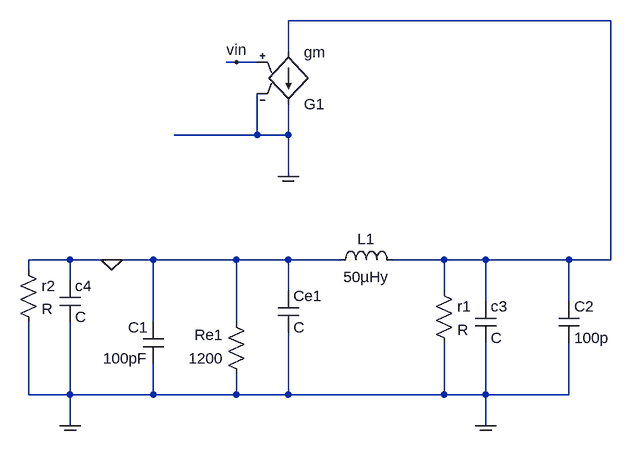
[diagram p0: schematic Collpits_g.asc]
Collpits_g.asc, the LTspice schematic file:
Version 4
SHEET 1 880 680
WIRE 720 -16 224 -16
WIRE 224 32 224 -16
WIRE 144 48 128 48
WIRE 176 48 144 48
WIRE 176 160 176 96
WIRE 176 160 48 160
WIRE 224 160 224 112
WIRE 224 160 176 160
WIRE 224 224 224 160
WIRE -112 352 -176 352
WIRE -48 352 -112 352
WIRE 16 352 -48 352
WIRE 144 352 16 352
WIRE 224 352 144 352
WIRE 304 352 224 352
WIRE 464 352 384 352
WIRE 528 352 464 352
WIRE 656 352 528 352
WIRE 720 352 720 -16
WIRE 720 352 656 352
WIRE -176 368 -176 352
WIRE -112 384 -112 352
WIRE 224 400 224 352
WIRE 464 400 464 352
WIRE 528 416 528 352
WIRE 656 416 656 352
WIRE 16 448 16 352
WIRE 144 448 144 352
WIRE -176 560 -176 448
WIRE -112 560 -112 448
WIRE -112 560 -176 560
WIRE 16 560 16 512
WIRE 16 560 -112 560
WIRE 144 560 144 528
WIRE 144 560 16 560
WIRE 224 560 224 464
WIRE 224 560 144 560
WIRE 464 560 464 480
WIRE 464 560 224 560
WIRE 528 560 528 480
WIRE 528 560 464 560
WIRE 656 560 656 480
WIRE 656 560 528 560
WIRE -112 608 -112 560
WIRE 528 608 528 560
FLAG 144 48 vin
FLAG 224 224 COM
FLAG -48 352 0
FLAG -112 608 COM
FLAG 528 608 COM
SYMBOL ind 288 368 R270
WINDOW 0 32 56 VTop 2
WINDOW 3 5 56 VBottom 2
SYMATTR InstName L1
SYMATTR Value 50µHy
SYMBOL res 160 544 R180
WINDOW 0 36 76 Left 2
WINDOW 3 36 40 Left 2
SYMATTR InstName Re1
SYMATTR Value 1200
SYMBOL cap 32 512 R180
WINDOW 0 24 56 Left 2
WINDOW 3 24 8 Left 2
SYMATTR InstName C1
SYMATTR Value 100pF
SYMBOL cap 640 416 R0
SYMATTR InstName C2
SYMATTR Value 100p
SYMBOL cap 208 400 R0
SYMATTR InstName Ce1
SYMBOL cap 512 416 R0
SYMATTR InstName c3
SYMBOL res 448 384 R0
SYMATTR InstName r1
SYMBOL g2 224 128 M180
SYMATTR InstName G1
SYMATTR Value gm
SYMBOL cap -128 384 R0
SYMATTR InstName c4
SYMBOL res -192 352 R0
SYMATTR InstName r2

The netlist it stands for:
* Collpits_g.asc
L1 0 N001 50µHy
Re1 COM 0 1200
C1 COM 0 100pF
C2 N001 COM 100p
Ce1 0 COM C
c3 N001 COM C
r1 N001 COM R
G1 N001 COM vin COM gm
c4 0 COM C
r2 0 COM R
.backanno
.end